# EAGLE design alim sym (EAGLE 9.2.2)
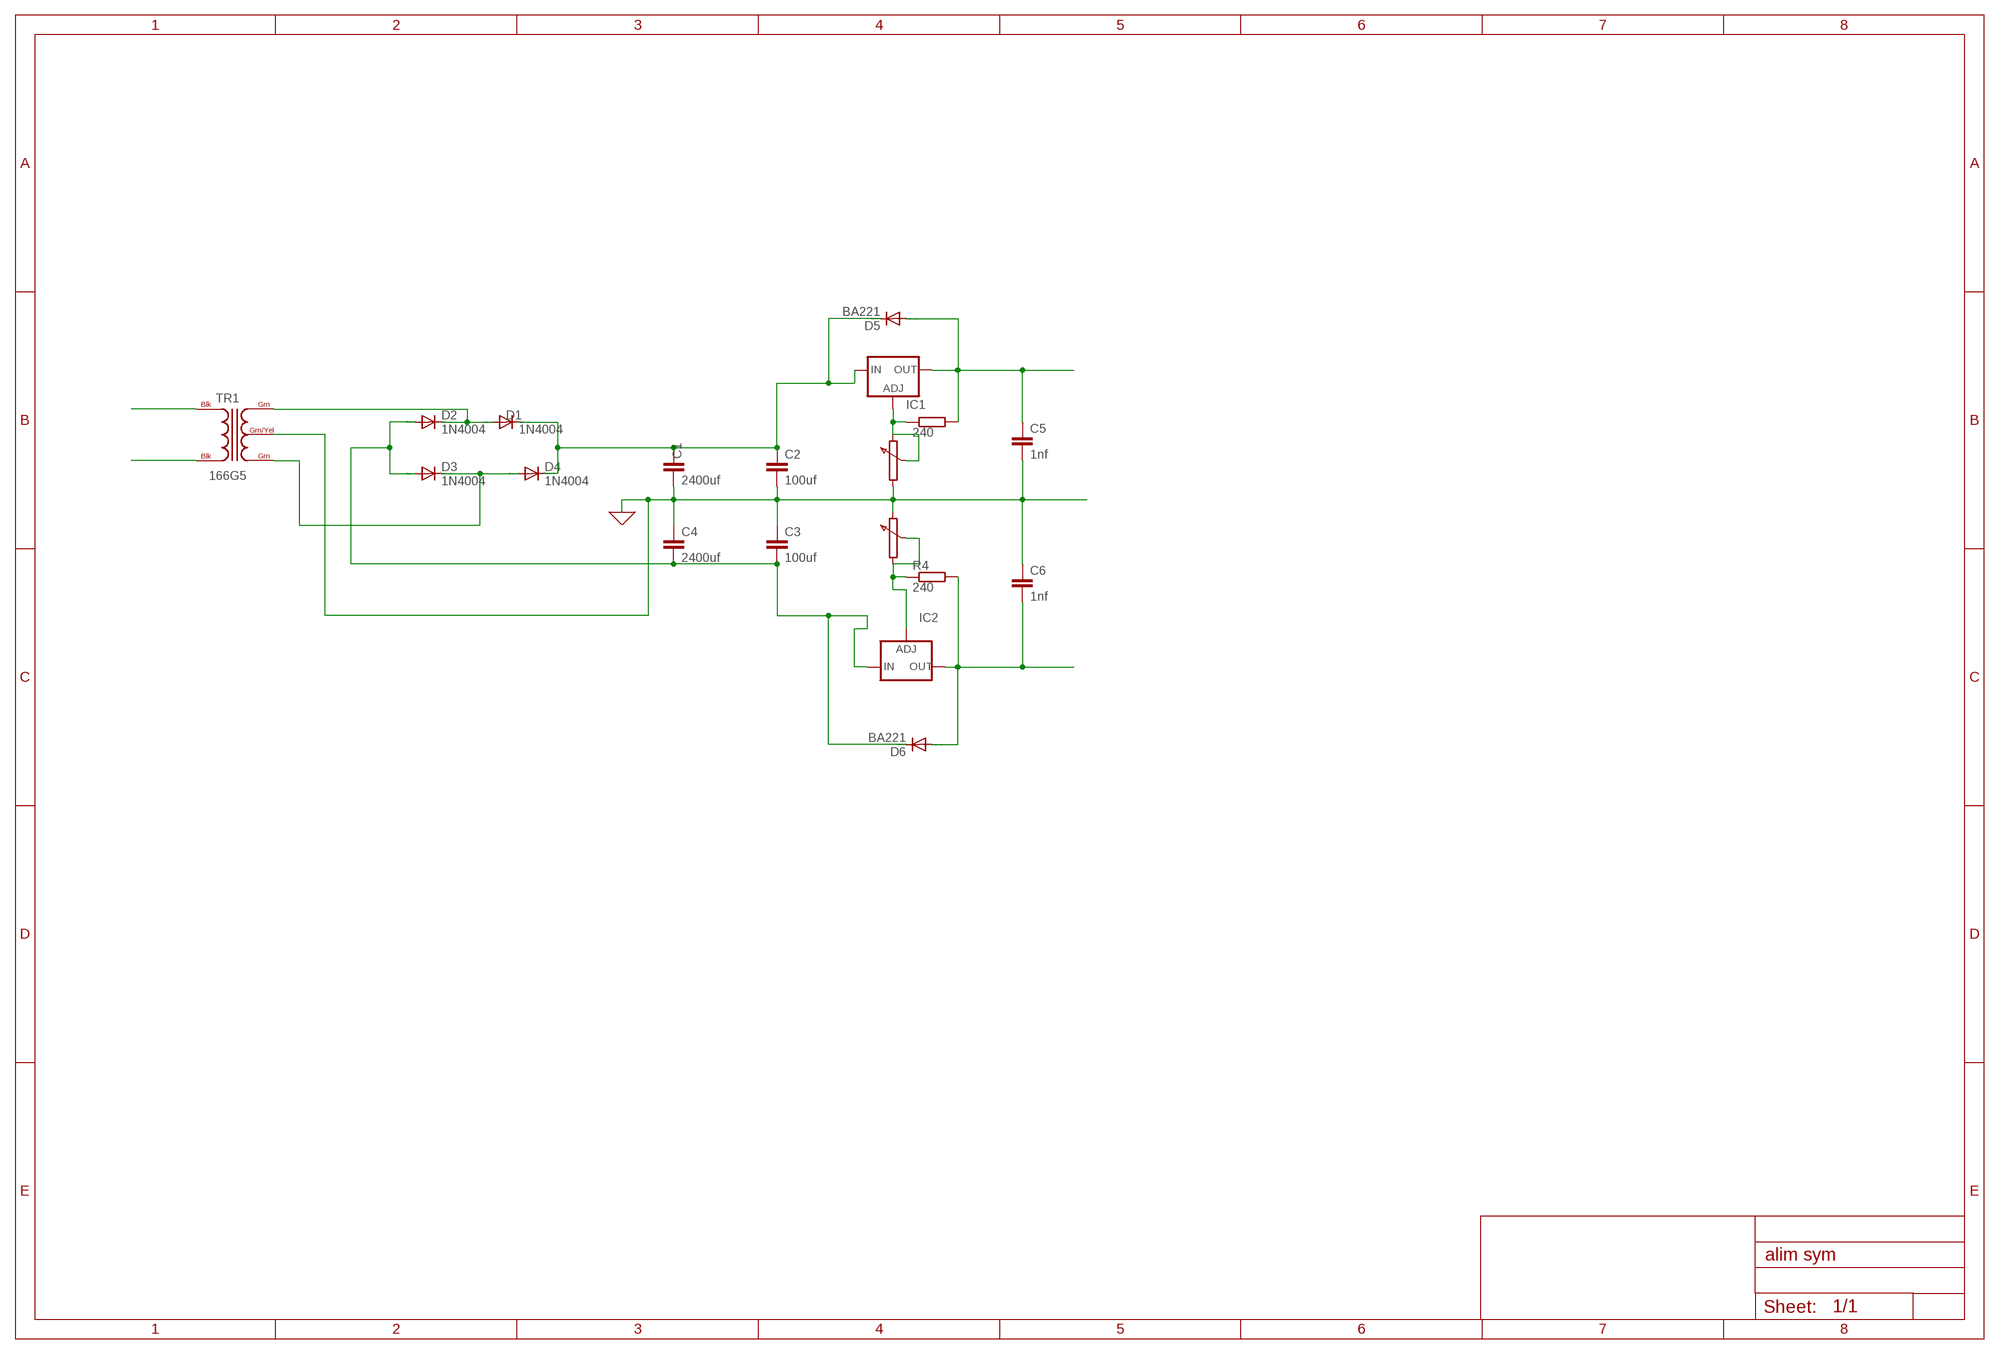
[diagram p0: schematic, sheet 1]

## Parts
C1  2400uf  C2,5-3  [C2.5-3]
C2  100uf  C2,5-3  [C2.5-3]
C3  100uf  C2,5-3  [C2.5-3]
C4  2400uf  C2,5-3  [C2.5-3]
C5  1nf  C2,5-3  [C2.5-3]
C6  1nf  C2,5-3  [C2.5-3]
D1  1N4004  [DO41-10]
D2  1N4004  [DO41-10]
D3  1N4004  [DO41-10]
D4  1N4004  [DO41-10]
D5  BA221  [DO35-10]
D6  BA221  [DO35-10]
IC1  LM317TS  [317TS]
IC2  LM337TS  [337TS]
R3  240  SMS-0  [SMS-0]
R4  240  SMS-0  [SMS-0]
TR1  166G5  [C3H]

## Nets
0: C1.2 C2.2 C3.1 C4.1 C5.2 C6.1 TR1.GRN/YEL ; supply symbol labelled GND
N$1: D1.A D2.C TR1.GRN@1(GRN)
N$2: D3.C D4.A TR1.GRN@2(GRN)
N$3: C1.1 C2.1 D1.C D4.C D5.C IC1.3(IN)
N$4: IC2.1(ADJ) R4.2
N$6: IC1.1(ADJ) R3.2
N$7: C3.2 C4.2 D2.A D3.A D6.C IC2.2(IN)
N$8: C6.2 D6.A IC2.3(OUT) R4.1
N$9: C5.1 D5.A IC1.2(OUT) R3.1
N$11: TR1.BLK@1(BLK)
N$12: TR1.BLK@2(BLK)

## Library data of the parts
C1-C6 = capacitor-wima:C: CAPACITOR naming: grid - package width
D1-D4 = diode:1N4004: DIODE general purpose rectifier, 1 A
D5 D6 = diode:BA221: DIODE high speed (Philips)
IC1 = v-reg:LM317TS: VOLTAGE REGULATOR
IC2 = v-reg:LM337TS: VOLTAGE REGULATOR
R3 R4 = resistor-shunt:SMS-0: SMD SHUNT RESISTOR; OC_FARNELL: unknown; OC_NEWARK: unknown
TR1 = trafo-hammondmfg:166: OPEN STYLE FILAMENT & L.V. RECTIFIER USE TRANSFORMERS Economical single primnary 115VAC, 60 Hz or 117 VAC 50/60 Hz Source: Data sheet <http://www.hammondmfg.com/166.htm>

## Board
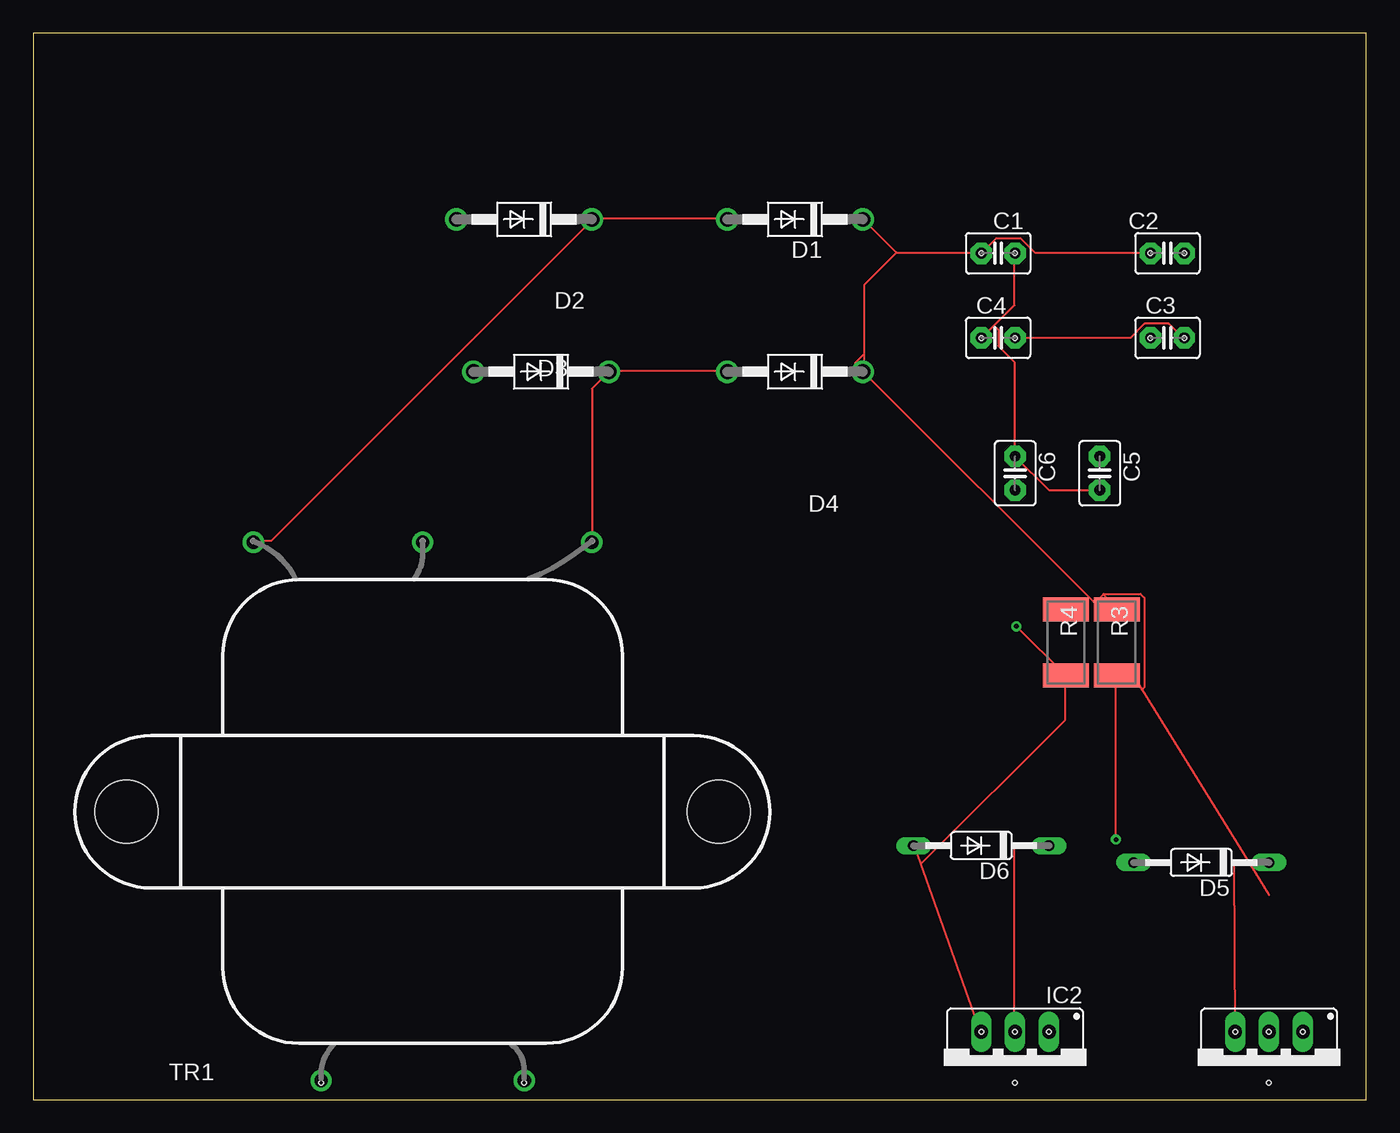
[diagram p1: board, top side]
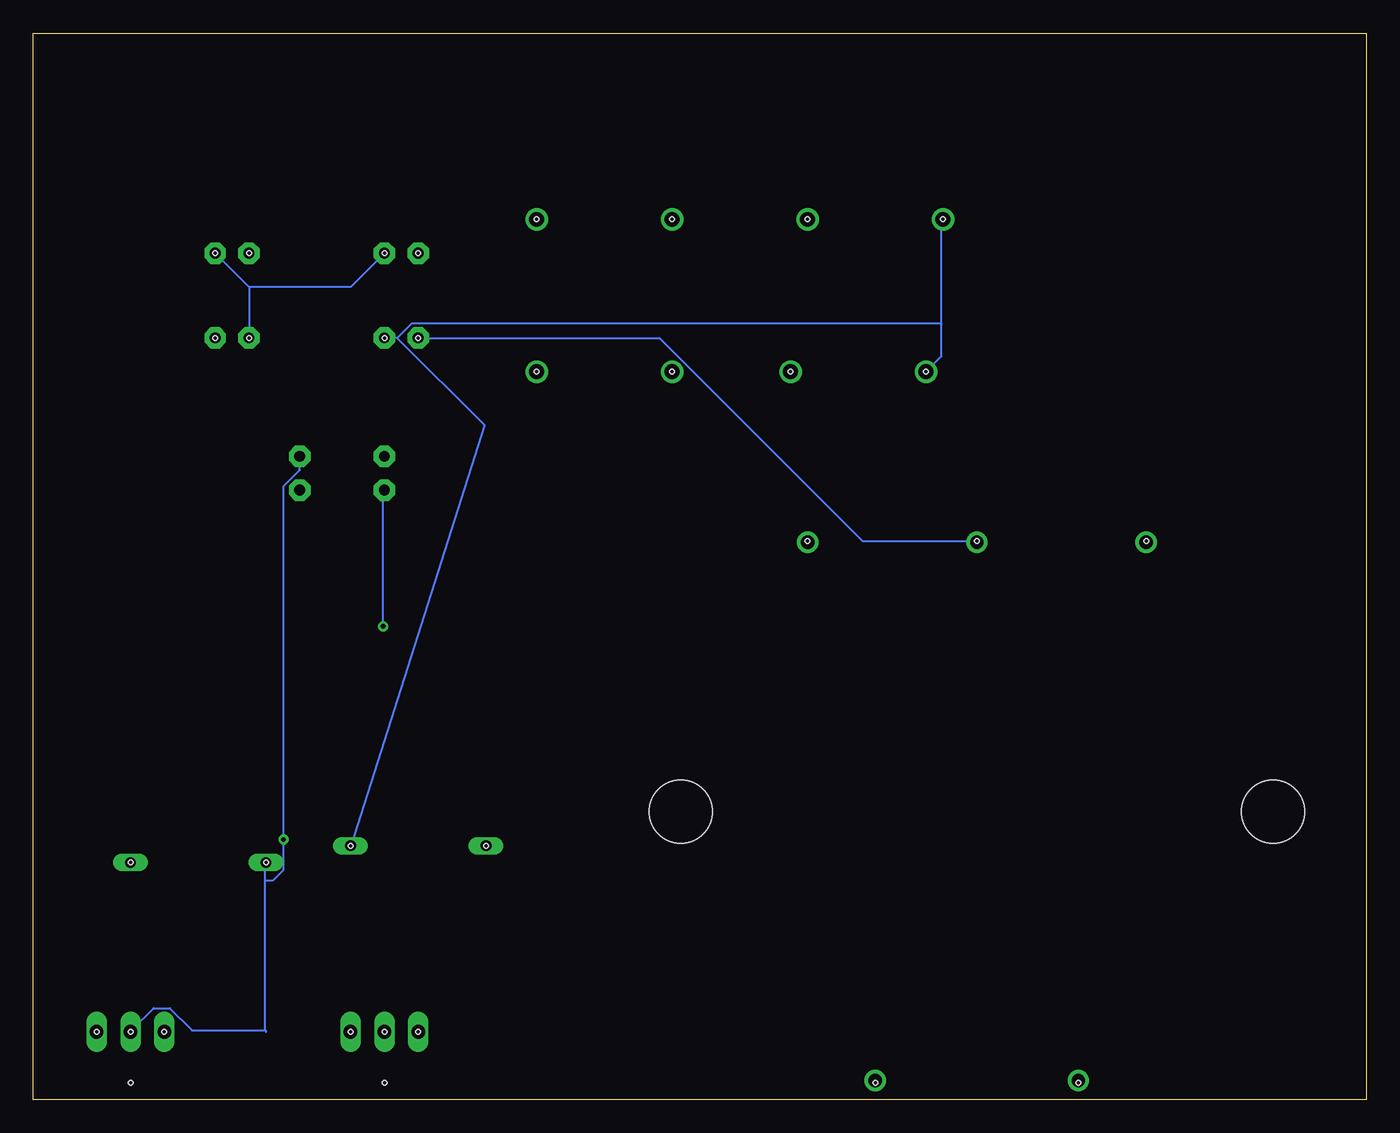
[diagram p2: board, bottom side, seen from below]

Size 100 x 80 mm. Coordinates in mm from the lower left corner, seen from the top.
Outline: 0,0 100,0 100,80 0,80 0,0
Copper layers (1*16): Top 0.035mm / dielectric 1.5mm / Bottom 0.035mm
Design rules "default": minimum track width 6mil, minimum drill 0.35mm, track to track 6mil, track to pad 6mil, pad to pad 6mil, via to via 6mil, smd to smd 6mil, copper to edge 40mil, drill to drill 6mil, minimum pad ring 10mil, minimum via ring 8mil, stop-mask expansion 4mil, vias tented up to drill 0mil, thermal gap 10mil
Holes 0.35 mm at 21.59,1.27 36.83,1.27 73.66,1.27 92.71,1.27 16.51,41.91 29.21,41.91 41.91,41.91 43.18,54.61 33.02,54.61 31.75,66.04 41.91,66.04 52.07,66.04 62.23,66.04 62.23,54.61 52.07,54.61 71.12,57.15 73.66,57.15 83.82,57.15 86.36,57.15 86.36,63.5 83.82,63.5 73.66,63.5 71.12,63.5 82.55,17.78 92.71,17.78 92.71,5.08 95.25,5.08 90.17,5.08 76.2,5.08 73.66,5.08 71.12,5.08 76.2,19.05 66.04,19.05

### Footprints (pad centres in the part's own frame; a part is rotated, then mirrored left to right if it is on the bottom)
C2.5-3 = drill 0.813 pad 1.6 octagon: 1 -1.27,0; 2 1.27,0
DO41-10 = drill 1.118: A 5.08,0; C -5.08,0
DO35-10 = drill 0.813 long: A 5.08,0; C -5.08,0
317TS = drill 1.016 long: 1 -2.54,-2.54; 2 0,-2.54; 3 2.54,-2.54
337TS = drill 1.016 long: 1 -2.54,-2.54; 2 0,-2.54; 3 2.54,-2.54
SMS-0 = smd 1.8 x 3.45: 1 2.464,0; 2 -2.464,0
C3H = drill 1 pad 1.6: BLK@1 -7.62,-20.17; BLK@2 7.62,-20.17; GRN/YEL 0,20.22; GRN@1 -12.7,20.22; GRN@2 12.7,20.22 | hole 4.75: 22.225,0; -22.225,0

### Placement (x,y rotation side)
C1  [C2.5-3]  72.39,63.5 0 top
C2  [C2.5-3]  85.09,63.5 0 top
C3  [C2.5-3]  85.09,57.15 0 top
C4  [C2.5-3]  72.39,57.15 0 top
C5  [C2.5-3]  80.01,46.99 270 top
C6  [C2.5-3]  73.66,46.99 270 top
D1  57.15,66.04 180 top
D2  36.83,66.04 180 top
D3  38.1,54.61 180 top
D4  57.15,54.61 180 top
D5  87.63,17.78 180 top
D6  71.12,19.05 180 top
IC1  92.71,2.54 180 top
IC2  73.66,2.54 180 top
R3  [SMS-0]  81.28,34.29 270 top
R4  [SMS-0]  77.47,34.29 270 top
TR1  29.21,21.59 0 top

### Tracks (layer width: path | path; a pad name or v marks a point on that pad's centre or on a via)
0
  Top 0.152: 72.08,58.06 71.17,57.15 C4.1 | 72.08,58.06 73.61,59.59 73.61,63.4 C1.2 | C5.2 76.2,45.72 C6.1 73.61,48.31 73.61,55.32 72.39,56.54 72.39,57.76 72.08,58.06
  Bottom 0.152: 83.82,60.96 C3.1 | C2.2 83.82,60.96 | C4.1 53.03,57.15 37.8,41.91 29.26,41.91 TR1.GRN/YEL | 83.82,60.96 76.2,60.96 C1.2
N$1
  Top 0.152: TR1.GRN@1 16.61,41.91 17.83,41.91 41.91,65.99 D2.C 41.91,66.14 51.97,66.14 D1.A
N$2
  Top 0.152: TR1.GRN@2 41.91,53.34 D3.C 43.28,54.71 51.97,54.71 D4.A
N$3
  Top 0.152: 91.29,17.73 90.12,17.73 IC1.3 | 91.29,17.73 92.71,17.73 D5.C 92.71,17.88 | 64.77,63.55 71.02,63.55 C1.1 72.24,64.62 74.07,64.62 75.13,63.55 83.82,63.55 C2.1 | 64.77,63.55 62.33,65.99 D1.C | 62.33,55.93 62.33,61.11 64.77,63.55 | 62.33,55.93 62.33,54.71 D4.C 62.33,54.56 | 82.45,31.9 83.16,30.75 | 83.16,30.75 91.27,17.67 | 91.27,17.67 92.71,15.34 | 62.33,54.56 61.65,55.24 62.33,55.93 | 62.33,54.56 79.63,37.26 80.26,37.9 | 80.26,37.9 81.18,36.98 | 91.29,17.73 91.29,17.68 91.27,17.67 | 83.16,30.75 83.21,30.79 83.36,30.94 83.36,37.64 83.06,37.95 80.31,37.95 80.26,37.9
N$7
  Top 0.152: D6.C 76.2,18.95 73.61,18.95 73.61,5.18 IC2.2 | C4.2 82.3,57.15 83.36,58.22 85.19,58.22 86.26,57.15 C3.2
  Bottom 0.152: 31.85,58.22 31.85,55.78 D3.A | 31.85,58.22 31.85,65.99 D2.A | 72.69,57.15 C4.2 | 72.69,57.15 71.63,58.22 31.85,58.22 | 72.69,57.15 66.14,50.6 76.2,18.95 D6.C
N$8  (via drill 0.35)
  Top 0.152: 66.59,17.68 71.02,5.18 IC2.3 | 66.59,17.68 66.14,18.95 D6.A | 66.59,17.68 66.6,17.68 77.42,28.5 77.42,31.7 R4.1 77.42,31.85 v73.76,35.51
  Bottom 0.152: v73.76,35.51 73.76,45.72 C6.2
N$9  (via drill 0.35)
  Top 0.152: v81.23,19.51 81.23,31.7 R3.1
  Bottom 0.152: 82.6,5.18 88.09,5.18 89.76,6.86 90.98,6.86 92.66,5.18 IC1.2 | 82.6,5.18 82.55,5.08 | 82.6,5.18 82.6,16.46 | 82.6,16.46 82.6,17.68 D5.A | 82.6,16.46 81.99,16.46 81.23,17.22 v81.23,19.51 81.23,46.02 80.01,47.24 C5.1